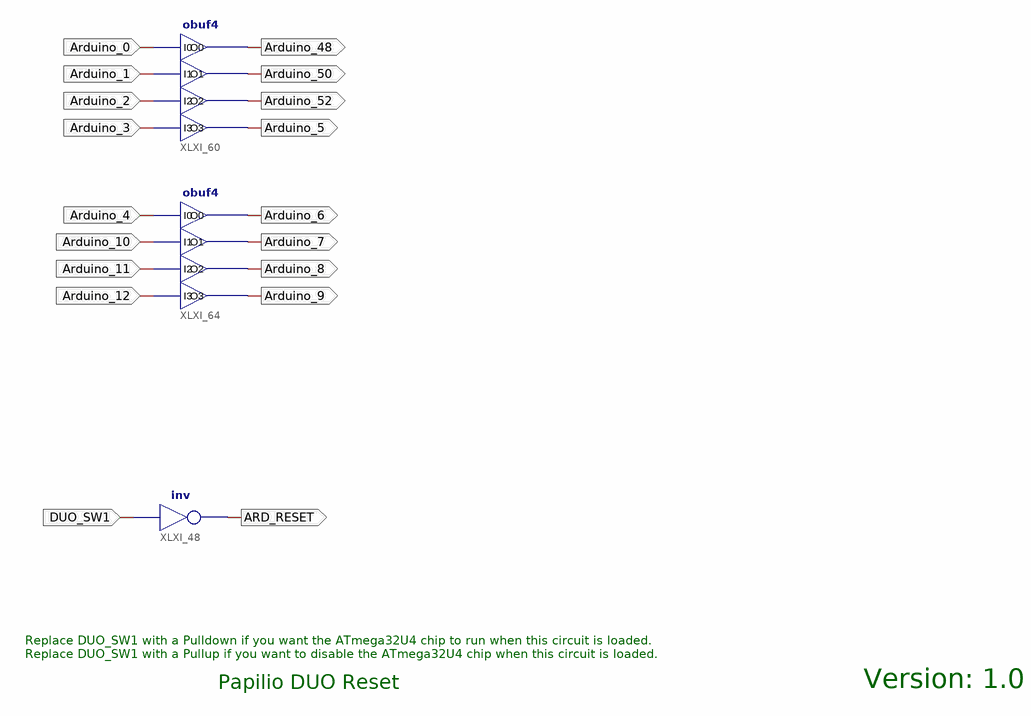
[diagram p0: schematic sheet 1]
// Xilinx ISE schematic Papilio_DUO_LX9.sch (spartan6) as structural Verilog: 3 symbols, 18 ports
module Papilio_DUO_LX9 (
  input  DUO_SW1,
  input  Arduino_0,
  input  Arduino_1,
  input  Arduino_2,
  input  Arduino_3,
  input  Arduino_4,
  input  Arduino_10,
  input  Arduino_11,
  input  Arduino_12,
  output ARD_RESET,
  output Arduino_48,
  output Arduino_50,
  output Arduino_52,
  output Arduino_5,
  output Arduino_6,
  output Arduino_7,
  output Arduino_8,
  output Arduino_9
);

  not XLXI_48 (ARD_RESET, DUO_SW1);
  obuf4 XLXI_60 (
    .I0(Arduino_0), .I1(Arduino_1), .I2(Arduino_2), .I3(Arduino_3), .O0(Arduino_48), .O1(Arduino_50),
    .O2(Arduino_52), .O3(Arduino_5));
  obuf4 XLXI_64 (
    .I0(Arduino_4), .I1(Arduino_10), .I2(Arduino_11), .I3(Arduino_12), .O0(Arduino_6), .O1(Arduino_7),
    .O2(Arduino_8), .O3(Arduino_9));

  // Notes on the sheet:
  //   Replace DUO_SW1 with a Pulldown if you want the ATmega32U4 chip to run when this circuit is loaded.
  //   Replace DUO_SW1 with a Pullup if you want to disable the ATmega32U4 chip when this circuit is loaded.
  //   Version: 1.0
  //   Papilio DUO Reset
endmodule
